# EasyEDA Pro project ProPrj_Book Nook Lamp_2026-02-12.epro

# Schematic Schematic1
Board Name: Board1; Create Date: 2026-02-09; Page Name: P1; Project Name: Book Nook Lamp; Schematic Name: Schematic1; Update Date: 2026-02-10; Company: EasyEDA.com; Page Size: A4; Version: V1.0
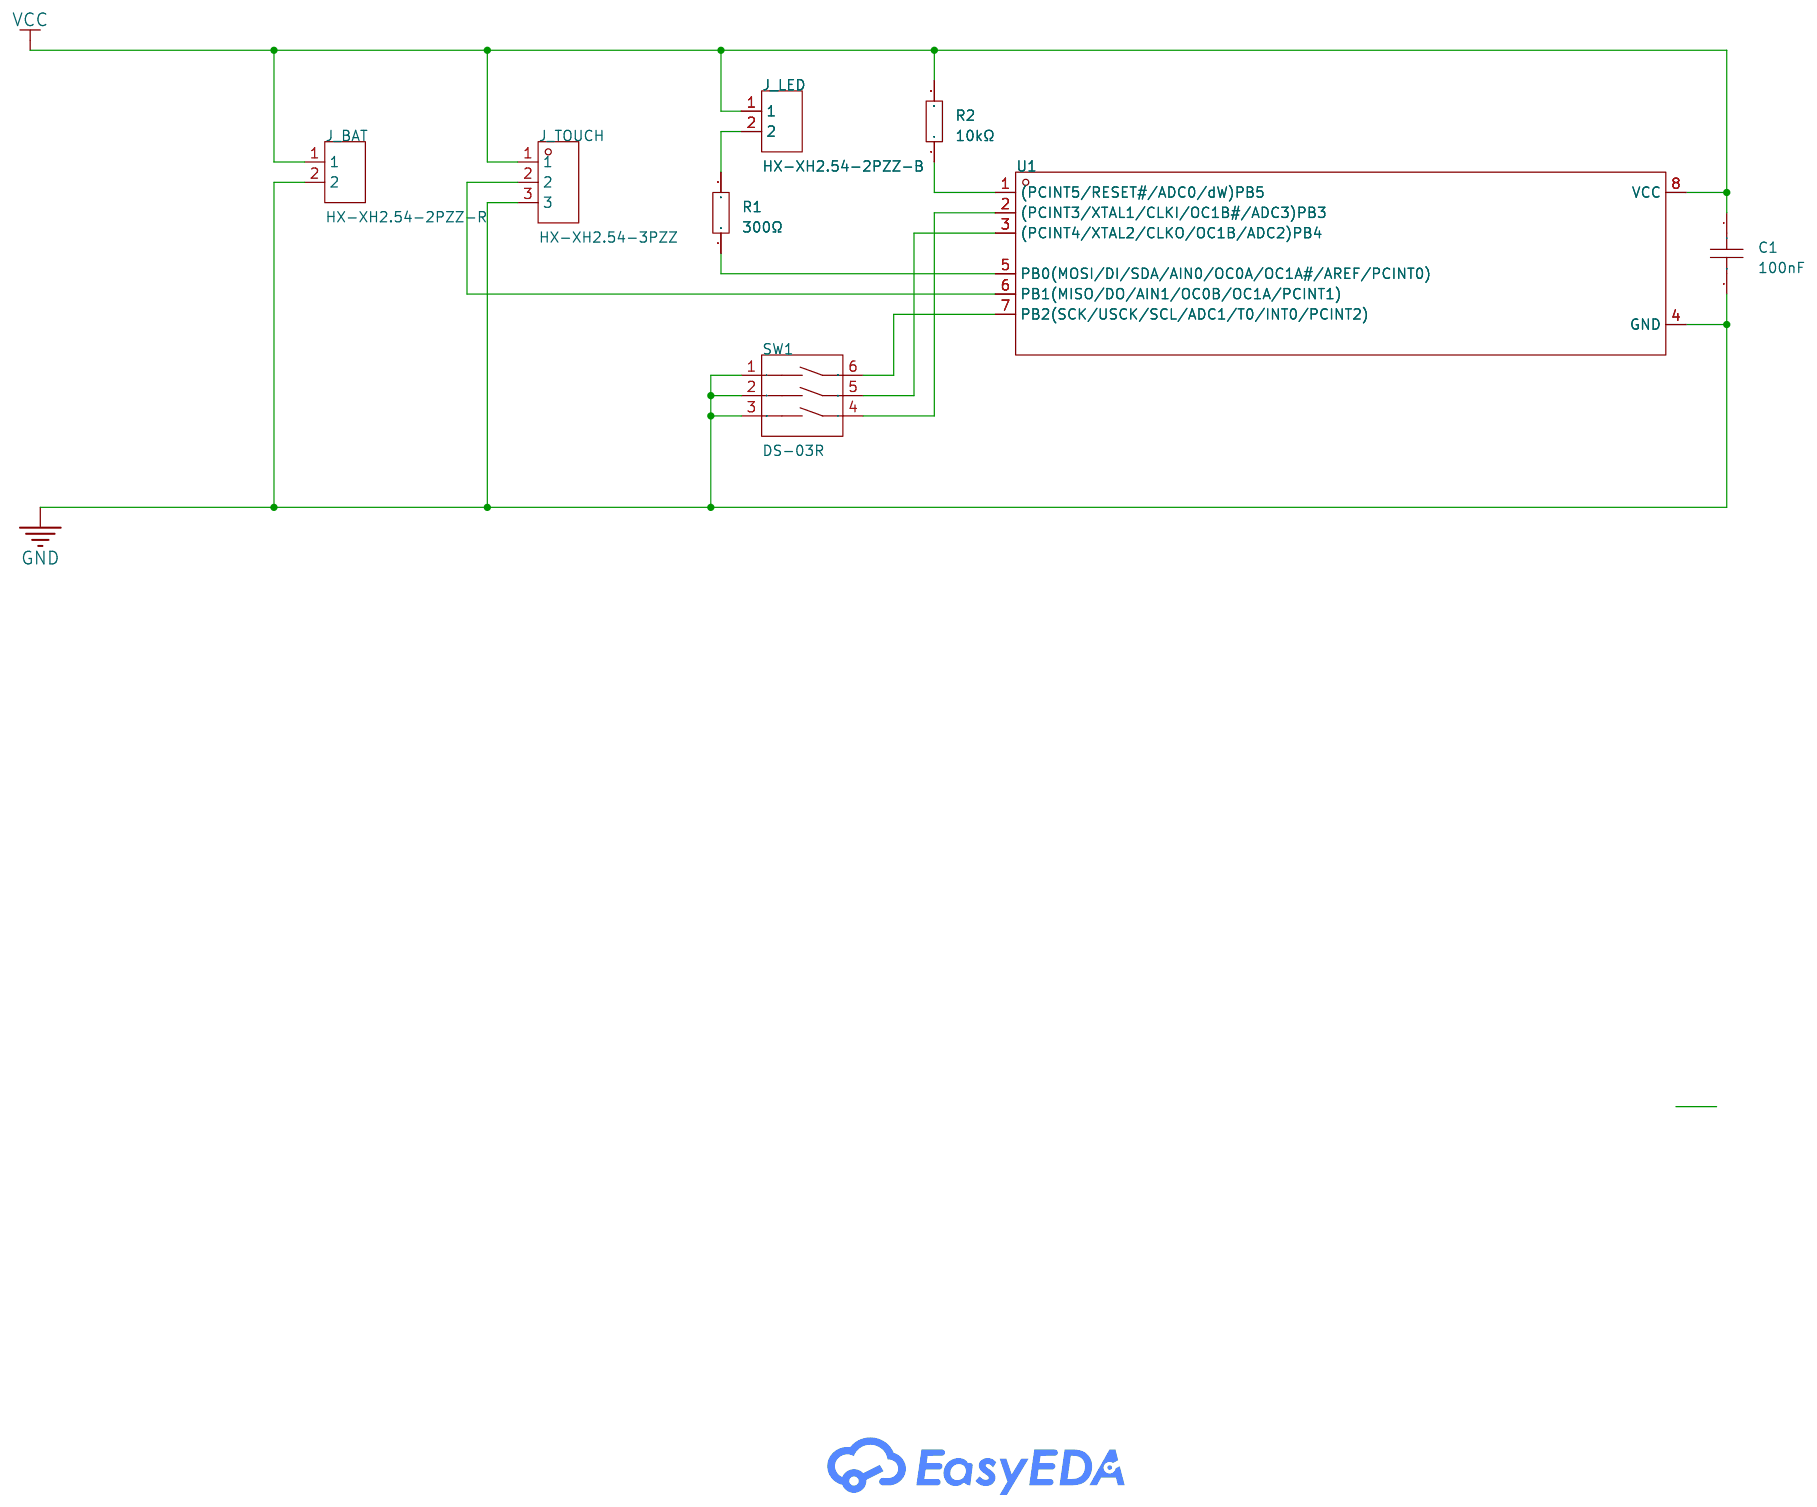
[diagram p0: schematic sheet]

## Parts
C1  100nF  [CAP-TH_L5.8-W2.4-P2.54-D0.6]
J_BAT  HX-XH2.54-2PZZ-R  [CONN-TH_2P-P2.50_HX-XH2.54-2PZZ-B]
J_LED  HX-XH2.54-2PZZ-B  [CONN-TH_2P-P2.50_HX-XH2.54-2PZZ-B]
J_TOUCH  HX-XH2.54-3PZZ  [CONN-TH_3P-P2.50_HC-XH-3A-G]
R1  300Ω  [RES-TH_BD2.3-L6.5-P10.50-D0.5]
R2  10kΩ  [RES-TH_BD2.7-L6.2-P10.20-D0.4]
SW1  DS-03R  [SW-TH_DSWB03LHGET]
U1  ATTINY85-20PU  [PDIP-8_L9.3-W6.4-P2.54-LS7.9-BL-1]

## Library data of the parts
C1 = CC1H104ZA1ED3F5P1100: Capacitance:100nF Tolerance:-20%~+80% Tolerance:-20%~+80% Voltage Rating:50V Pin Spacing:2.54mm Temperature Coefficient:Y5V Diameter:5.8mm Body Thickness:2.4mm; LCSC Part Name: 100nF -20%~+80% 50V; Supplier Part: C2832506; Manufacturer: Dersonic(德尔创); Supplier Footprint: 插件,P=2.54mm; JLCPCB Part Class: Extended Part; Datasheet: https://item.szlcsc.com/datasheet/CC1H104ZA1ED3F5P1100/2990644.html; Supplier: LCSC; Tolerance: -20%~+80%; Voltage Rating: 50V; Pin Spacing: 2.54mm; Temperature Coefficient: Y5V; Diameter: 5.8mm; Body Thickness: 2.4mm
J_BAT = HX-XH2.54-2PZZ-R: Pins Structure:1x2P Pitch:2.54mm Mounting Type:Through Hole Reference Series:XH Number of Pins:2P Number of Rows:1 Number of PINs Per Row:2 Row Spacing:- Current Rating:3A Contact Material:Brass Contact Plating:Tin Operating Temperature:-25℃~+85℃ Operatin; LCSC Part Name: 1x2P 间距:2.54mm 直插 系列:XH; Supplier Part: C49010010; Manufacturer: hanxia(韩下); Supplier Footprint: 插件,P=2.5mm; JLCPCB Part Class: Extended Part; Datasheet: https://item.szlcsc.com/datasheet/HX-XH2.54-2PZZ-R/51365931.html; Supplier: LCSC; Pins Structure: 1x2P; Pitch: 2.54mm; Mounting Type: Through Hole; Reference Series: XH; Number of Pins: 2P; Number of Rows: 1; Number of PINs Per Row: 2; Current Rating: 3A; Contact Material: Brass; Contact Plating: Tin; Operating Temperature: -25℃~+85℃; Voltage Rating: 250V; Plastic Material: PA66; Flame Retardant Rating: UL94V-0; Color: Red
J_LED = HX-XH2.54-2PZZ-B: Pins Structure:1x2P Pitch:2.54mm Mounting Type:Through Hole Reference Series:XH Number of Pins:2P Number of Rows:1 Number of PINs Per Row:2 Row Spacing:- Current Rating:3A Contact Material:Brass Contact Plating:Tin Operating Temperature:-25℃~+85℃ Operatin; LCSC Part Name: 1x2P 间距:2.54mm 直插 系列:XH; Supplier Part: C49010018; Manufacturer: hanxia(韩下); Supplier Footprint: 插件,P=2.5mm; JLCPCB Part Class: Extended Part; Datasheet: https://item.szlcsc.com/datasheet/HX-XH2.54-2PZZ-B/51365939.html; Supplier: LCSC; Pins Structure: 1x2P; Pitch: 2.54mm; Mounting Type: Through Hole; Reference Series: XH; Number of Pins: 2P; Number of Rows: 1; Number of PINs Per Row: 2; Current Rating: 3A; Contact Material: Brass; Contact Plating: Tin; Operating Temperature: -25℃~+85℃; Voltage Rating: 250V; Plastic Material: PA66; Flame Retardant Rating: UL94V-0; Color: Black
J_TOUCH = HX-XH2.54-3PZZ: Pins Structure:1x3P Pitch:2.54mm Mounting Type:Through Hole Reference Series:XH Number of Pins:3P Number of Rows:1 Number of PINs Per Row:3 Row Spacing:- Current Rating:3A Contact Material:Brass Contact Plating:Tin Operating Temperature:-25℃~+85℃ Operatin; LCSC Part Name: 1x3P 间距:2.54mm 直插 系列:XH; Supplier Part: C42391661; Manufacturer: hanxia(韩下); Supplier Footprint: 插件,P=2.5mm; JLCPCB Part Class: Extended Part; Datasheet: https://item.szlcsc.com/datasheet/HX-XH2.54-3PZZ/44326933.html; Supplier: LCSC; Pins Structure: 1x3P; Pitch: 2.54mm; Mounting Type: Through Hole; Reference Series: XH; Number of Pins: 3P; Number of Rows: 1; Number of PINs Per Row: 3; Current Rating: 3A; Contact Material: Brass; Contact Plating: Tin; Operating Temperature: -25℃~+85℃; Voltage Rating: 250V; Plastic Material: PA66; Flame Retardant Rating: UL94V-0; Color: White
R1 = MF1/4W-300Ω±1%T52: Type:Metal Film Resistors Resistance: Tolerance:±1% Tolerance:±1% Power(Watts):250mW Temperature Coefficient:±200ppm/℃ Temperature Coefficient:±200ppm/℃; LCSC Part Name: 金属膜电阻 300Ω ±1% 250mW; Supplier Part: C713985; Manufacturer: 华星机电; Supplier Footprint: 插件,D2.3xL6.5mm; JLCPCB Part Class: Extended Part; Datasheet: https://atta.szlcsc.com/upload/public/pdf/source/20200731/C713882_AE8EB1102749D7E4FB4FB13DC898C429.pdf; Supplier: LCSC; Type: Metal Film Resistors; Tolerance: ±1%; Power(Watts): 250mW; Temperature Coefficient: ±200ppm/℃
R2 = MF1/4W-10K±1%-ST26: Type:Metal Film Resistors Resistance: Tolerance:±1% Tolerance:±1% Overload Voltage (Max):250V Power(Watts):250mW Temperature Coefficient:±100ppm/℃ Temperature Coefficient:±100ppm/℃ Operating Temperature Range:-55℃~+155℃ Operating Temperature Range:-55℃~+1; LCSC Part Name: 金属膜电阻 10kΩ ±1% 250mW; Supplier Part: C2903267; Manufacturer: VO(翔胜); Supplier Footprint: 插件,D2.7xL6.2mm; JLCPCB Part Class: Extended Part; Datasheet: https://atta.szlcsc.com/upload/public/pdf/source/20200609/C601728_5AA4C0C8E12E11069DA2C3356F29D1F2.pdf; Supplier: LCSC; Type: Metal Film Resistors; Tolerance: ±1%; Overload Voltage (Max): 250V; Power(Watts): 250mW; Temperature Coefficient: ±100ppm/℃; Operating Temperature Range: -55℃~+155℃
SW1 = DS-03R: Type:Slide, Rocked Circuit:SPST Number of Positions:3 Termination Style:PC Pin Lead Pitch:2.54mm; LCSC Part Name: 2.54mm 平拨,凸起式 3位; Supplier Part: C25503178; Manufacturer: HanElectricity(瀚源); Supplier Footprint: 插件,P=2.54mm; JLCPCB Part Class: Extended Part; Datasheet: https://item.szlcsc.com/datasheet/DS-03R/27233721.html; Supplier: LCSC; Type: Slide, Rocked; Circuit: SPST; Number of Positions: 3; Termination Style: PC Pin; Lead Pitch: 2.54mm
U1 = ATTINY85-20PU: CPU Core:AVR CPU Maximum Speed:20MHz Core Size:8 Bit Program Storage Size:8KB Program Memory Type:FLASH RAM Size:512Byte EEPROM:512Byte Number of I/O:6 ADC (Bit):10bit Oscillator Type:Built-in Voltage - Supply:2.7V~5.5V Voltage - Supply:2.7V~5.5V Operatin; LCSC Part Name: 8位AVR微控制器，2/4/8K字节系统内可编程闪存; Supplier Part: C965497; Manufacturer: MICROCHIP(美国微芯); Supplier Footprint: PDIP-8; JLCPCB Part Class: Extended Part; Datasheet: https://item.szlcsc.com/datasheet/ATTINY85-20PU/1052792.html; Supplier: LCSC; CPU Core: AVR; CPU Maximum Speed: 20MHz; Core Size: 8 Bit; Program Storage Size: 8KB; Program Memory Type: FLASH; RAM Size: 512Byte; EEPROM: 512Byte; Number of I/O: 6; ADC (Bit): 10bit; Oscillator Type: Built-in; Voltage - Supply: 2.7V~5.5V; Operating Temperature: -40℃~+85℃

## Nets
GND: C1.2 J_BAT.2 J_TOUCH.3 SW1.1 SW1.2 SW1.3 U1.4(GND)
VCC: C1.1 J_BAT.1 J_LED.1 J_TOUCH.1 R2.2 U1.8(VCC)
$1N1996: R2.1 U1.1((PCINT5/RESET#/ADC0/dW)PB5)
$1N3164: J_LED.2 R1.2
$1N3172: R1.1 U1.5(PB0(MOSI/DI/SDA/AIN0/OC0A/OC1A#/AREF/PCINT0))
$1N3359: SW1.6 U1.7(PB2(SCK/USCK/SCL/ADC1/T0/INT0/PCINT2))
$1N3365: SW1.5 U1.3((PCINT4/XTAL2/CLKO/OC1B/ADC2)PB4)
$1N3372: SW1.4 U1.2((PCINT3/XTAL1/CLKI/OC1B#/ADC3)PB3)
$1N4670: J_TOUCH.2 U1.6(PB1(MISO/DO/AIN1/OC0B/OC1A/PCINT1))

# Board PCB1
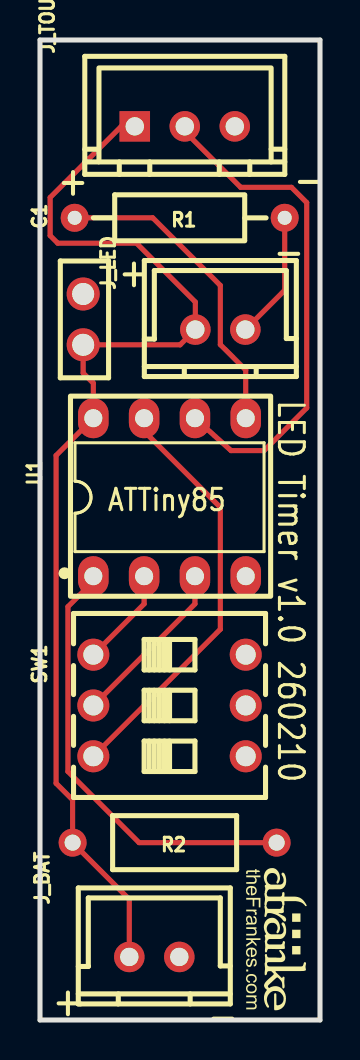
[diagram p1: board, top side]
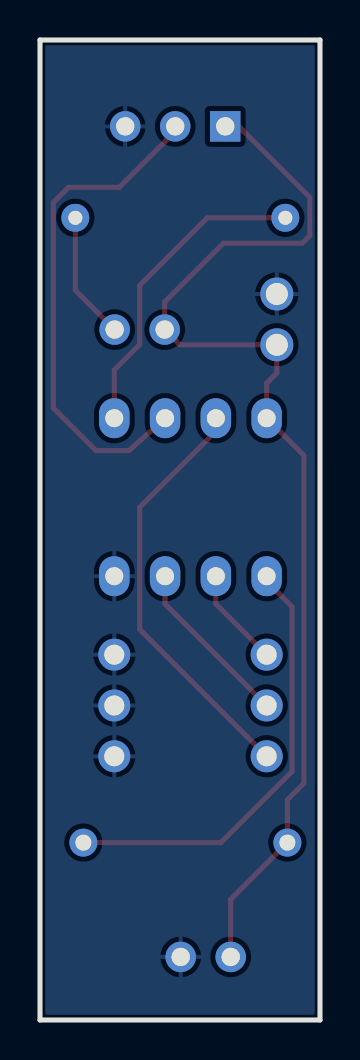
[diagram p2: board, bottom side, seen from below]

Outline 14 x 49 mm; copper layers: Top Layer, Bottom Layer. Coordinates in mm from the lower left corner of the outline.
Outline path: 0,49 14,49 14,0 0,0 0,49
Stack: Top Layer 0.035mm / Dielectric1 1.51mm FR4 er 4.5 / Bottom Layer 0.035mm

## Design rules (mm)
template: JLCPCB Capability(Two Layers Board)
spacing copperThickness1oz (default): track to track 0.102, other pairs 0.152 to 0.3
spacing copperThickness2oz: track to track 0.203, other pairs 0.152 to 0.3
track width copperThickness1oz (default): min 0.127, default 0.254, max 2.54
track width copperThickness2oz: min 0.203, default 0.254, max 2.54
differential pair differentialPair (default): width min 0.127, default 0.254, max 2.54; gap min 0.152, default 0.152
via viaSize (default): diameter min 0.5, default 0.61, max 10; hole min 0.3, default 0.305, max 6.3

## Placement (name value [footprint] x y rotation side)
C1  100nF  [CAP-TH_L5.8-W2.4-P2.54-D0.6]  2.16 35.03 90 top
J_BAT  HX-XH2.54-2PZZ-R  [CONN-TH_2P-P2.50_HX-XH2.54-2PZZ-B]  5.72 3.15 0 top
J_LED  HX-XH2.54-2PZZ-B  [CONN-TH_2P-P2.50_HX-XH2.54-2PZZ-B]  9.02 34.52 0 top
J_TOUCH  HX-XH2.54-3PZZ  [CONN-TH_3P-P2.50_HC-XH-3A-G]  7.24 44.68 0 top
R1  300Ω  [RES-TH_BD2.3-L6.5-P10.50-D0.5]  6.99 40.11 0 top
R2  10kΩ  [RES-TH_BD2.7-L6.2-P10.20-D0.4]  6.73 8.87 180 top
SW1  DS-03R  [SW-TH_DSWB03LHGET]  6.48 15.73 270 top
U1  ATTINY85-20PU  [PDIP-8_L9.3-W6.4-P2.54-LS7.9-BL-1]  6.48 26.14 0 top

## Footprints (pads in the part's own frame, mm; a bottom-side part is the same pattern mirrored in y, then rotated)
CAP-TH_L5.8-W2.4-P2.54-D0.6
  round 1.65 hole 1.1: 1(-1.27,0) 2(1.27,0)
CONN-TH_2P-P2.50_HX-XH2.54-2PZZ-B
  round 1.524 hole 0.914: 1(-1.25,0) 2(1.25,0)
CONN-TH_3P-P2.50_HC-XH-3A-G
  rect 1.524x1.524 hole 0.914: 1(-2.5,0)
  round 1.524 hole 0.914: 2(0,0) 3(2.5,0)
PDIP-8_L9.3-W6.4-P2.54-LS7.9-BL-1
  oval 1.524x2 hole 0.9: 1(-3.81,-3.95) 2(-1.27,-3.95) 3(1.27,-3.95) 4(3.81,-3.95) 5(3.81,3.95) 6(1.27,3.95) 7(-1.27,3.95) 8(-3.81,3.95)
RES-TH_BD2.3-L6.5-P10.50-D0.5
  round 1.4 hole 0.7: 1(-5.25,0) 2(5.25,0)
RES-TH_BD2.7-L6.2-P10.20-D0.4
  round 1.4 hole 0.8: 1(-5.1,0) 2(5.1,0)
SW-TH_DSWB03LHGET
  round 1.6 hole 1: 1(-2.54,3.81) 2(0,3.81) 3(2.54,3.81) 4(-2.54,-3.81) 5(0,-3.81) 6(2.54,-3.81)

## Nets
As in the schematic.

## Routing (per net, layer and track width the routed paths; a pad name or vN(x,y) marks a point on that pad's centre or on a via; arc(x,y) is an arc through that point)
VCC: length 56.6
  Top Layer w0.254: J_TOUCH.1 4.06,44.68 0.51,41.13 0.51,39.22 0.89,38.84 4.83,38.84 7.77,35.9 J_LED.1 7,33.76 C1.1 2.16,32.35 2.67,31.84 U1.8 0.81,28.23 0.81,11.83 1.63,11.01 R2.2 4.47,6.03 J_BAT.1
$1N1996: length 21.9
  Top Layer w0.254: 2.67,21.94 1.4,20.67 1.4,12.42 4.95,8.87 R2.1
$1N3164: length 6.4
  Top Layer w0.254: J_LED.2 12.24,36.49 R1.2
$1N3172: length 15.6
  Top Layer w0.254: R1.1 5.63,40.11 9.02,36.73 9.02,33.77 10.29,32.5 10.29,30.34
$1N3359: length 21.1
  Top Layer w0.254: SW1.6 9.02,19.54 9.02,25.63 5.21,29.44 U1.7
$1N3365: length 8.6
  Top Layer w0.254: SW1.5 7.75,20.81 U1.3
$1N3372: length 5
  Top Layer w0.254: SW1.4 5.21,20.81 U1.2
$1N4670: length 24.9
  Top Layer w0.254: U1.6 9.55,28.47 11.2,28.47 13.34,30.6 13.34,40.87 12.57,41.63 10.03,41.63 7.24,44.43

## Copper pours and planes (outline as drawn; the poured copper is in the pictures)
GND on Bottom Layer: 0,49 14,49 14,0 0,0

## Text on the board
Top Silkscreen Layer: ATTiny85 | LED Timer v1.0 260210 | + | -
